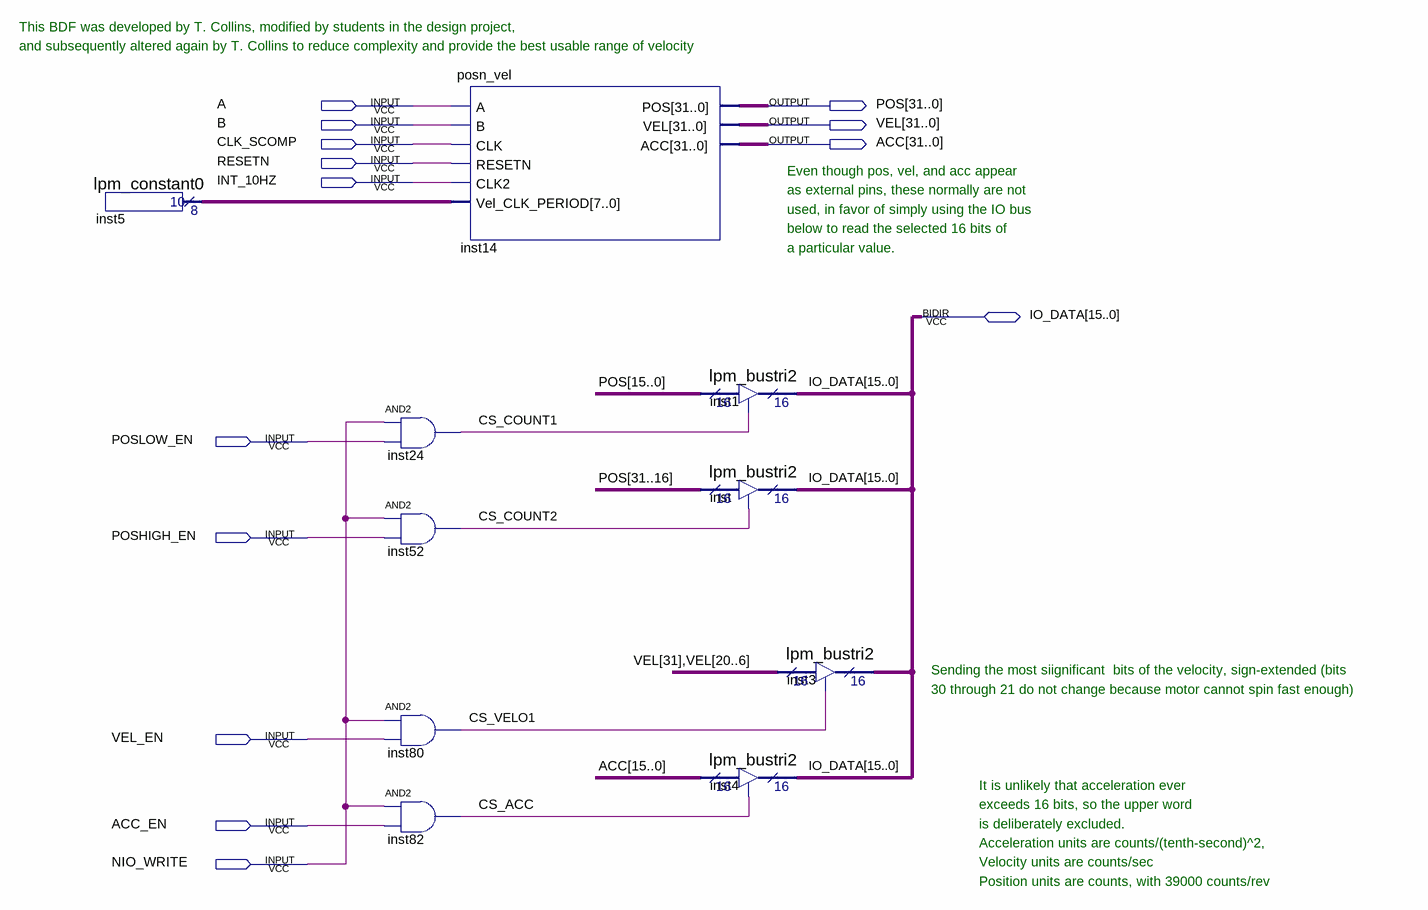
[diagram p0: schematic sheet]
// Quartus schematic OpticalEncoder.bdf as structural Verilog: 10 symbols, 14 pins
module OpticalEncoder (
  input  A,
  input  B,
  input  CLK_SCOMP,
  input  RESETN,
  input  INT_10HZ,
  input  POSLOW_EN,
  input  POSHIGH_EN,
  input  VEL_EN,
  input  ACC_EN,
  input  NIO_WRITE,
  inout  [15:0] IO_DATA,
  output [31:0] POS,
  output [31:0] VEL,
  output [31:0] ACC
);

  wire CS_ACC, CS_COUNT1, CS_COUNT2, CS_VELO1;
  wire [7:0] inst5_result;

  lpm_constant0 inst5 (.result(inst5_result));
  and inst24 (CS_COUNT1, NIO_WRITE, POSLOW_EN);
  and inst52 (CS_COUNT2, NIO_WRITE, POSHIGH_EN);
  and inst80 (CS_VELO1, NIO_WRITE, VEL_EN);
  and inst82 (CS_ACC, NIO_WRITE, ACC_EN);
  posn_vel inst14 (
    .A(A), .B(B), .CLK(CLK_SCOMP), .RESETN(RESETN), .CLK2(INT_10HZ), .Vel_CLK_PERIOD(inst5_result),
    .POS(POS), .VEL(VEL), .ACC(ACC));
  lpm_bustri2 inst1 (.enabledt(CS_COUNT1), .data(POS[15:0]), .tridata(IO_DATA));
  lpm_bustri2 inst (.enabledt(CS_COUNT2), .data(POS[31:16]), .tridata(IO_DATA));
  lpm_bustri2 inst4 (.enabledt(CS_ACC), .data(ACC[15:0]), .tridata(IO_DATA));
  lpm_bustri2 inst3 (.enabledt(CS_VELO1), .data({VEL[31], VEL[20:6]}), .tridata(IO_DATA));

  // Notes on the sheet:
  //   This BDF was developed by T. Collins, modified by students in the design project,
  //   and subsequently altered again by T. Collins to reduce complexity and provide the best usable range of velocity
  //   Even though pos, vel, and acc appear
  //   as external pins, these normally are not
  //   used, in favor of simply using the IO bus
  //   below to read the selected 16 bits of
  //   a particular value.
  //   Sending the most siignificant  bits of the velocity, sign-extended (bits
  //   30 through 21 do not change because motor cannot spin fast enough)
  //   It is unlikely that acceleration ever
  //   exceeds 16 bits, so the upper word
  //   is deliberately excluded.
  //   Acceleration units are counts/(tenth-second)^2,
  //   Velocity units are counts/sec
  //   Position units are counts, with 39000 counts/rev
endmodule
